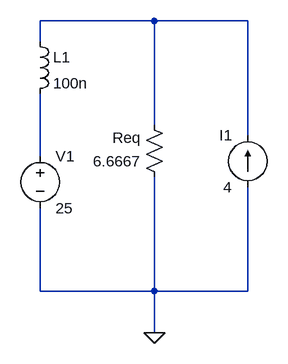
[diagram p0: schematic close-simple.asc]
close-simple.asc, the LTspice schematic file:
Version 4
SHEET 1 880 680
WIRE 16 -64 -160 -64
WIRE 160 -64 16 -64
WIRE -160 -32 -160 -64
WIRE 16 96 16 -64
WIRE 160 112 160 -64
WIRE -160 144 -160 48
WIRE -160 352 -160 224
WIRE 16 352 16 176
WIRE 16 352 -160 352
WIRE 160 352 160 192
WIRE 160 352 16 352
WIRE 16 416 16 352
FLAG 16 416 0
SYMBOL voltage -160 128 R0
SYMATTR InstName V1
SYMATTR Value 25
SYMBOL res 32 192 R180
WINDOW 0 36 76 Left 2
WINDOW 3 36 40 Left 2
SYMATTR InstName Req
SYMATTR Value 6.6667
SYMBOL current 160 192 R180
WINDOW 0 24 80 Left 2
WINDOW 3 24 0 Left 2
WINDOW 123 0 0 Left 0
WINDOW 39 0 0 Left 0
SYMATTR InstName I1
SYMATTR Value 4
SYMBOL ind -176 -48 R0
SYMATTR InstName L1
SYMATTR Value 100n

The netlist it stands for:
* close-simple.asc
V1 N002 0 25
Req 0 N001 6.6667
I1 0 N001 4
L1 N001 N002 100n
.backanno
.end